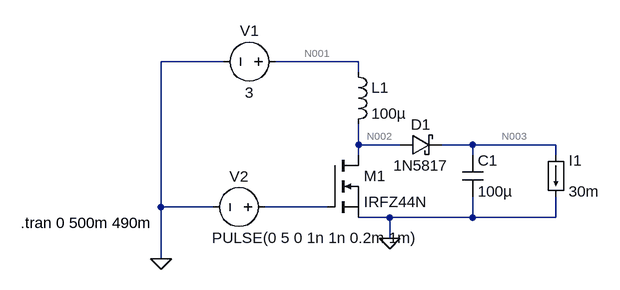
[diagram p0: schematic led_driver.asc]
led_driver.asc, the LTspice schematic file:
Version 4
SHEET 1 880 680
WIRE -48 64 -144 64
WIRE 160 64 32 64
WIRE 160 80 160 64
WIRE 160 192 160 160
WIRE 224 192 160 192
WIRE 336 192 288 192
WIRE 464 192 336 192
WIRE 160 208 160 192
WIRE 336 208 336 192
WIRE 464 208 464 192
WIRE -144 288 -144 64
WIRE -64 288 -144 288
WIRE 112 288 16 288
WIRE 208 304 160 304
WIRE 336 304 336 272
WIRE 336 304 208 304
WIRE 464 304 464 272
WIRE 464 304 336 304
WIRE 208 336 208 304
WIRE -144 368 -144 288
FLAG 208 336 0
FLAG -144 368 0
SYMBOL ind 144 64 R0
SYMATTR InstName L1
SYMATTR Value 100µ
SYMATTR SpiceLine Rser=0.3
SYMBOL cap 320 208 R0
SYMATTR InstName C1
SYMATTR Value 100µ
SYMBOL voltage 48 64 R90
WINDOW 0 -32 56 VBottom 2
WINDOW 3 32 56 VTop 2
WINDOW 123 0 0 Left 2
WINDOW 39 0 0 Left 2
SYMATTR InstName V1
SYMATTR Value 3
SYMBOL voltage 32 288 R90
WINDOW 0 -32 56 VBottom 2
WINDOW 3 32 -61 VTop 2
WINDOW 123 0 0 Left 2
WINDOW 39 0 0 Left 2
SYMATTR InstName V2
SYMATTR Value PULSE(0 5 0 1n 1n 0.2m 1m)
SYMBOL schottky 224 208 R270
WINDOW 0 32 32 VTop 2
WINDOW 3 0 32 VBottom 2
SYMATTR InstName D1
SYMATTR Value 1N5817
SYMATTR Description Diode
SYMATTR Type diode
SYMBOL nmos 112 208 R0
SYMATTR InstName M1
SYMATTR Value IRFZ44N
SYMBOL load 448 208 R0
WINDOW 123 0 0 Left 2
WINDOW 39 0 0 Left 2
SYMATTR InstName I1
SYMATTR Value 30m
TEXT -360 312 Left 2 !.tran 0 500m 490m

The netlist it stands for:
* led_driver.asc
L1 N001 N002 100µ Rser=0.3
C1 N003 0 100µ
V1 N001 0 3
V2 N004 0 PULSE(0 5 0 1n 1n 0.2m 1m)
D1 N002 N003 1N5817
M1 N002 N004 0 0 IRFZ44N
I1 N003 0 30m
.model D D
.lib standard.dio
.model NMOS NMOS
.model PMOS PMOS
.lib standard.mos
.tran 0 500m 490m
.backanno
.end

* Results of the author's LTspice run, read from the files saved beside the schematic
* Operating Point, zero values left out:
*   V(n001) = 3 V
*   V(n002) = 2.991 V
*   V(n003) = 2.746 V
*   Id(M1) = 4.506 pA
*   Is(M1) = -4.506 pA
*   I(D1) = 30 mA
*   I(L1) = 30 mA
*   I(I1) = 30 mA
*   I(V1) = -30 mA